# EAGLE design bustracker (EAGLE 7.6.0)
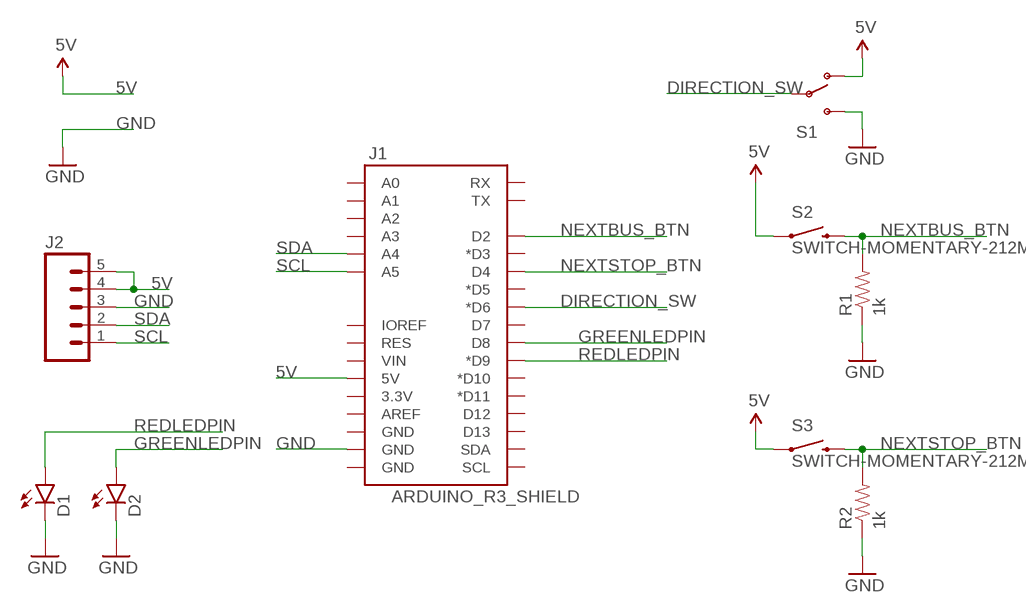
[diagram p0: schematic, sheet 1]

## Parts
D1  LED5MM  [LED5MM]
D2  LED5MM  [LED5MM]
J1  ARDUINO_R3_SHIELD  [UNO_R3_SHIELD]
J2  M05PTH  [1X05]
R1  1k  1KOHM-1/4W-5%(PTH)  [AXIAL-0.3]
R2  1k  1KOHM-1/4W-5%(PTH)  [AXIAL-0.3]
S1  SWITCH-SPDTPTH  [SWITCH-SPDT]
S2  SWITCH-MOMENTARY-212MM  [TACTILE-PTH-12MM]
S3  SWITCH-MOMENTARY-212MM  [TACTILE-PTH-12MM]

## Nets
5V: J1.5V J2.4 J2.5 S1.1(O) S2.1 S3.1
DIRECTION_SW: J1.D6(*D6) S1.2(P)
GND: D1.K(C) D2.K(C) J1.GND@1(GND) J2.3 R1.P$1 R2.P$1 S1.3(S)
GREENLEDPIN: D2.A J1.D8
NEXTBUS_BTN: J1.D2 R1.P$2 S2.3
NEXTSTOP_BTN: J1.D4 R2.P$2 S3.3
REDLEDPIN: D1.A J1.D9(*D9)
SCL: J1.A5 J2.1
SDA: J1.A4 J2.2
Unconnected: J1.3.3V J1.A0 J1.A1 J1.A2 J1.A3 J1.AREF J1.D3(*D3) J1.D5(*D5) J1.D7 J1.D10(*D10) J1.D11(*D11) J1.D12 J1.D13 J1.GND@0(GND) J1.GND@2(GND) J1.IOREF J1.RES J1.RX J1.SCL J1.SDA J1.TX J1.VIN

## Library data of the parts
D1 D2 = SparkFun-LED:LED: LEDs Standard schematic elements and footprints for 5mm, 3mm, 1206, and 0603 sized LEDs. 5mm - Spark Fun Electronics SKU : COM-00529 (and others)
J1 = SparkFun-Boards:ARDUINO_R3_SHIELD: Shield form compatible with the Arduino Uno R3.
J2 = SparkFun-Connectors:M05: Header 5 Standard 5-pin 0.1" header. Use with straight break away headers (SKU : PRT-00116), right angle break away headers (PRT-00553), swiss pins (PRT-00743), machine pins (PRT-00117), and female headers (PRT-00115). Molex polarized connector foot print use with SKU : PRT-08230 with associated crimp pins and housings.
R1 R2 = SparkFun-Resistors:1KOHM-1/4W-5%(PTH): RES-08380; PROD_ID: RES-08380
S1 = SparkFun-Electromechanical:SWITCH-SPDT: SPDT Switch Simple slide switch, Spark Fun Electronics SKU : COM-00102 DPDT SMT slide switch, AYZ0202, SWCH-08179; PROD_ID: SWCH-08261
S2 S3 = SparkFun-Electromechanical:SWITCH-MOMENTARY-2: Various NO switches- pushbuttons, reed, etc; PROD_ID: SWCH-09185

## Board
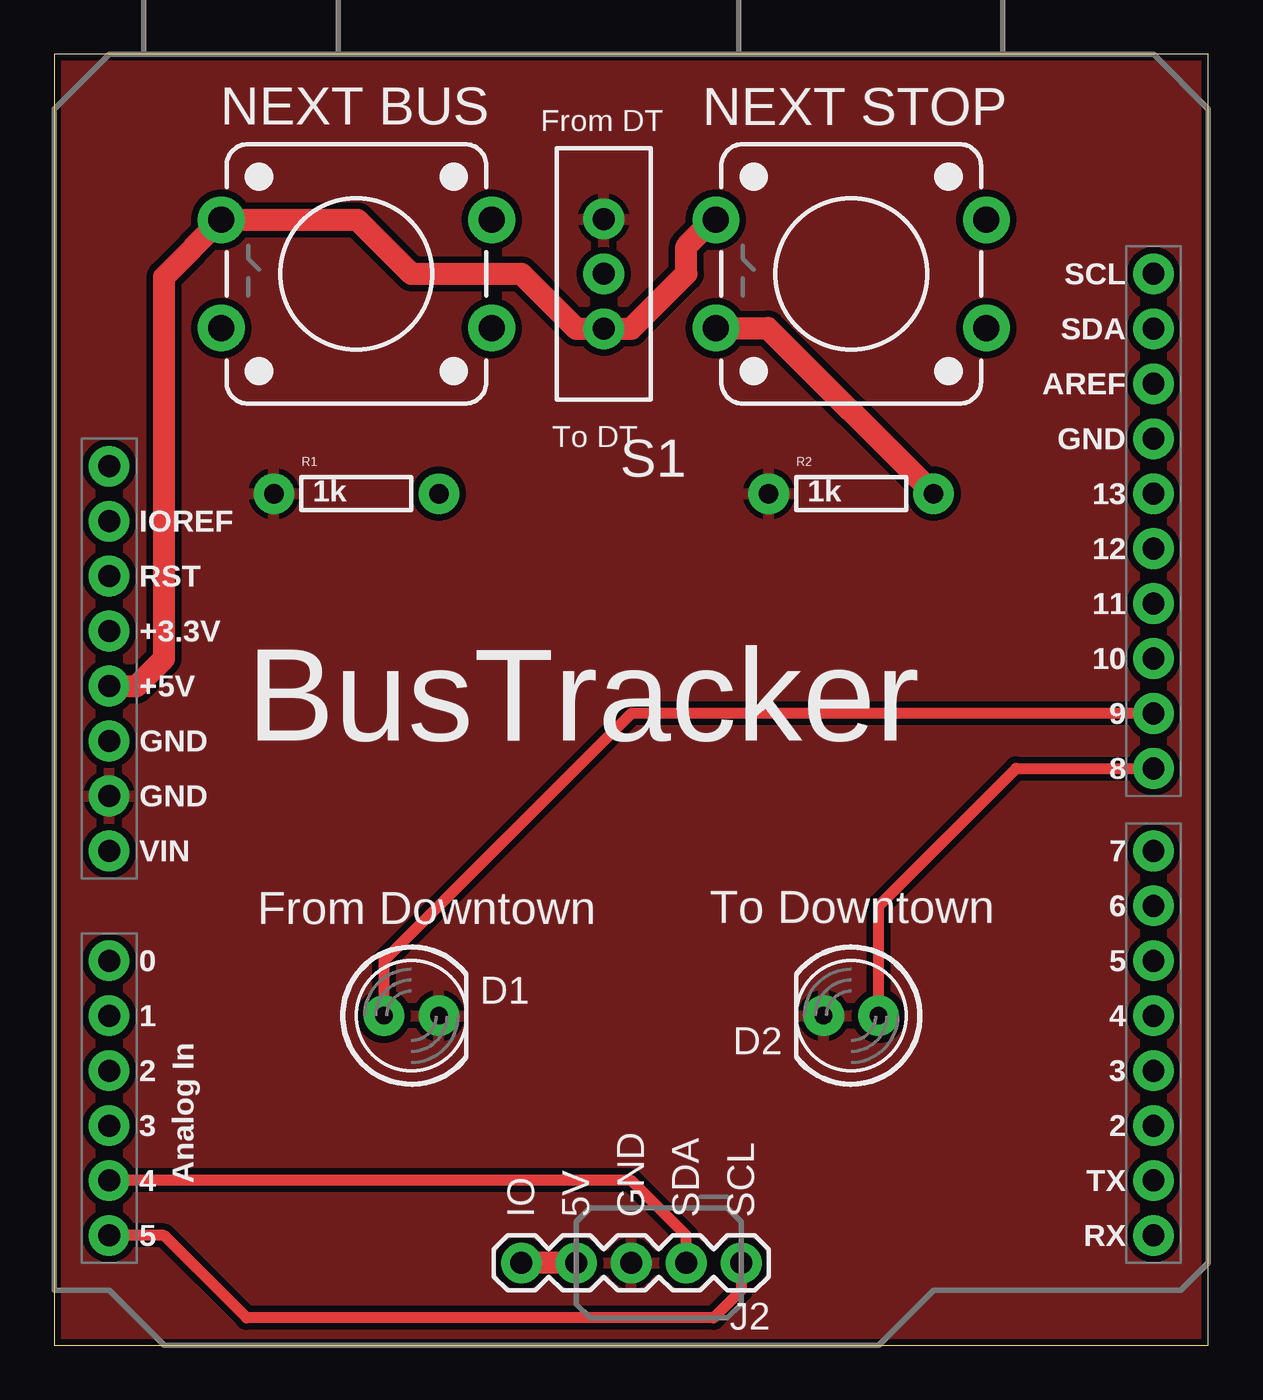
[diagram p1: board, top side]
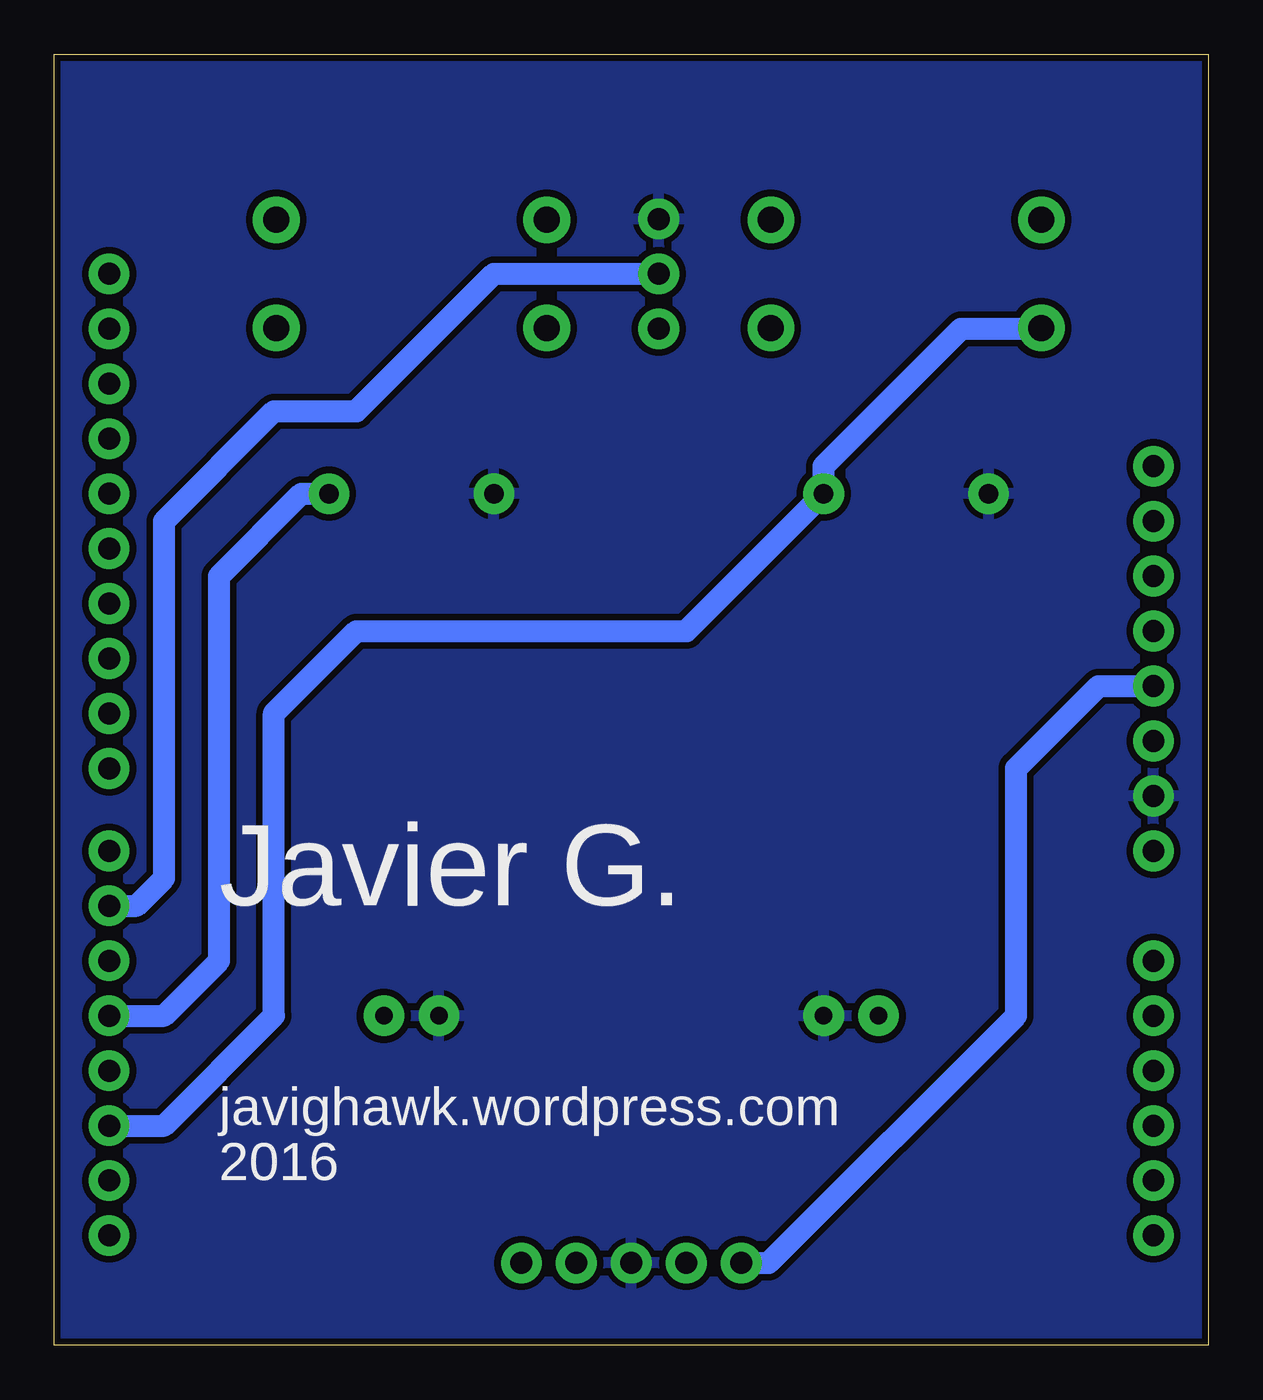
[diagram p2: board, bottom side, seen from below]

Size 53.34 x 59.69 mm. Coordinates in mm from the lower left corner, seen from the top.
Outline: 53.34,59.69 0,59.69 0,0 53.34,0.01 53.34,59.69
Copper layers (1*16): Top 0.035mm / dielectric 1.5mm / Bottom 0.035mm
Design rules "SparkFun": minimum track width 8mil, minimum drill 20mil, track to track 8mil, track to pad 8mil, pad to pad 8mil, via to via 8mil, smd to smd 8mil, copper to edge 10mil, drill to drill 8mil, minimum pad ring 12mil, minimum via ring 10mil, stop-mask expansion 4mil, vias tented up to drill 25mil, thermal gap 10mil

### Footprints (pad centres in the part's own frame; a part is rotated, then mirrored left to right if it is on the bottom)
LED5MM = drill 0.813 pad 1.88: A -1.27,0; K 1.27,0
UNO_R3_SHIELD = drill 1.016 pad 1.88: 3.3V 50.8,26.67; 5V 50.8,29.21; A0 50.8,41.91; A1 50.8,44.45; A2 50.8,46.99; A3 50.8,49.53; A4 50.8,52.07; A5 50.8,54.61; AREF 2.54,15.24; D2 2.54,49.53; D3 2.54,46.99; D4 2.54,44.45; D5 2.54,41.91; D6 2.54,39.37; D7 2.54,36.83; D8 2.54,33.02; D9 2.54,30.48; D10 2.54,27.94; D11 2.54,25.4; D12 2.54,22.86; D13 2.54,20.32; GND@0 50.8,31.75; GND@1 50.8,34.29; GND@2 2.54,17.78; IOREF 50.8,21.59; NC 50.8,19.05; RES 50.8,24.13; RX 2.54,54.61; SCL 2.54,10.16; SDA 2.54,12.7; TX 2.54,52.07; VIN 50.8,36.83
1X05 = drill 1.016 pad 1.88: 1 0,0; 2 2.54,0; 3 5.08,0; 4 7.62,0; 5 10.16,0
AXIAL-0.3 = drill 0.9 pad 1.88: P$1 -3.81,0; P$2 3.81,0
SWITCH-SPDT = drill 1.016 pad 1.88: 1 0,2.54; 2 0,0; 3 0,-2.54
TACTILE-PTH-12MM = drill 1.2 pad 2.159: 1 6.25,-2.5; 2 -6.25,-2.5; 3 6.25,2.5; 4 -6.25,2.5

### Placement (x,y rotation side)
D1  16.51,15.24 0 top
D2  36.83,15.24 180 top
J1  53.34,59.69 180 top
J2  31.75,3.81 180 top
R1  13.97,39.37 0 top
R2  36.83,39.37 0 top
S1  25.4,49.53 180 top
S2  13.97,49.53 180 top
S3  36.83,49.53 180 top

### Tracks (layer width: path | path; a pad name or v marks a point on that pad's centre or on a via)
5V
  Top 1.016: J2.4 J2.5 | J1.5V 3.81,30.48 5.08,31.75 5.08,49.39 S2.1 14.01,52.03 16.51,49.53 21.59,49.53 24.13,46.99 S1.1 26.67,46.99 29.21,49.53 29.21,50.8 30.44,52.03 S3.1
  Bottom 1.016: J2.5 20.32,3.81 8.89,15.24 8.89,26.67 5.08,30.48 J1.5V
DIRECTION_SW
  Bottom 1.016: J1.D6 49.53,20.32 48.26,21.59 48.26,38.1 43.18,43.18 39.37,43.18 33.02,49.53 S1.2
GND
  pour Top (isolate 0.305): 53.34,0 0,0 0,59.69 53.34,59.69
  pour Bottom (isolate 0.305): 53.34,0 0,0 0,59.69 53.34,59.69
GREENLEDPIN
  Top 0.508: D2.A 38.1,20.32 44.45,26.67 J1.D8
NEXTBUS_BTN
  Top 1.016: 7.76,46.99 S2.3
  Bottom 1.016: J1.D2 48.26,10.16 43.18,15.24 43.18,29.21 39.37,33.02 24.13,33.02 R1.P$2 17.78,40.64 11.43,46.99 7.76,46.99 S2.3
NEXTSTOP_BTN
  Top 1.016: S3.3 32.98,47.03 R2.P$2
  Bottom 1.016: J1.D4 48.26,15.24 45.72,17.78 45.72,35.56 41.91,39.37 R2.P$2
REDLEDPIN
  Top 0.508: J1.D9 26.67,29.21 15.24,17.78 D1.A
SCL
  Top 0.508: J2.1 31.75,2.54 30.48,1.27 8.89,1.27 5.08,5.08 J1.A5
SDA
  Top 0.508: J2.2 29.21,5.08 26.67,7.62 J1.A4

### Text on the board
tPlace: NEXT BUS | From DT | NEXT STOP | To DT | BusTracker | From Downtown | To Downtown | IO | 5V | GND | SDA | SCL
bPlace: Javier G. | javighawk.wordpress.com | 2016